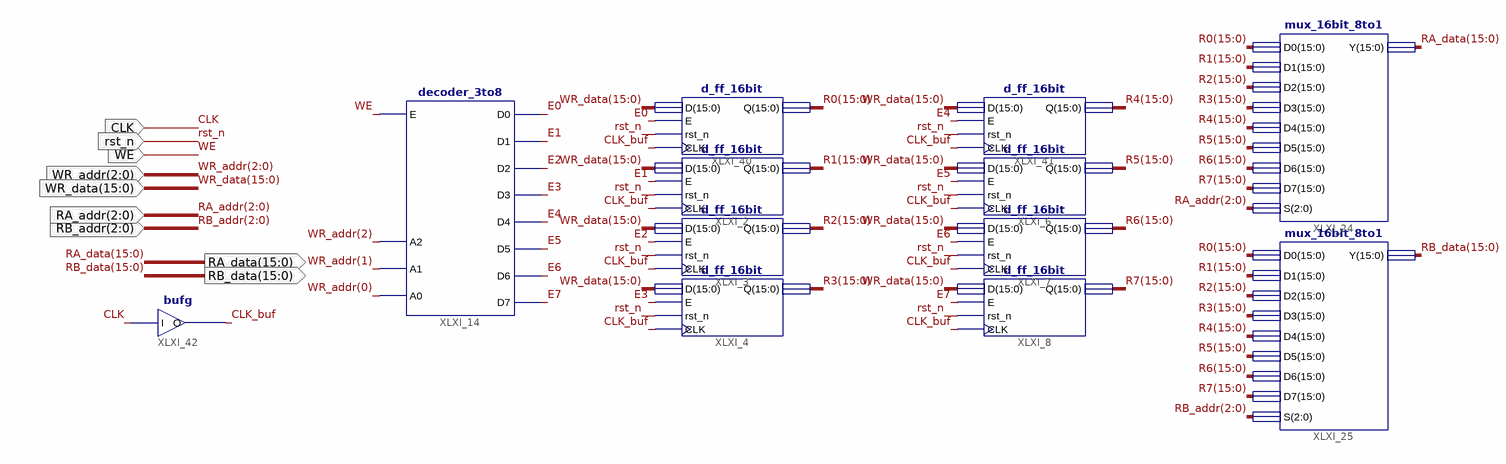
[diagram p0: schematic sheet 1]
// Xilinx ISE schematic regfile_16bit_8reg.sch (virtex6) as structural Verilog: 12 symbols, 9 ports
module regfile_16bit_8reg (
  input  WE,
  input  [15:0] WR_data,
  input  [2:0] WR_addr,
  input  [2:0] RB_addr,
  input  [2:0] RA_addr,
  input  CLK,
  input  rst_n,
  output [15:0] RA_data,
  output [15:0] RB_data
);

  wire CLK_buf, E0, E1, E2, E3, E4, E5, E6, E7;
  wire [15:0] R0, R1, R2, R3, R4, R5, R6, R7;

  decoder_3to8 XLXI_14 (
    .D0(E0), .D1(E1), .D2(E2), .D3(E3), .D4(E4), .D5(E5), .D6(E6), .D7(E7), .A0(WR_addr[0]), .A1(WR_addr[1]),
    .A2(WR_addr[2]), .E(WE));
  mux_16bit_8to1 XLXI_24 (
    .S(RA_addr), .D7(R7), .D6(R6), .D5(R5), .D4(R4), .D3(R3), .D2(R2), .D1(R1), .D0(R0), .Y(RA_data));
  mux_16bit_8to1 XLXI_25 (
    .S(RB_addr), .D7(R7), .D6(R6), .D5(R5), .D4(R4), .D3(R3), .D2(R2), .D1(R1), .D0(R0), .Y(RB_data));
  d_ff_16bit XLXI_8 (.E(E7), .D(WR_data), .Q(R7), .CLK(CLK_buf), .rst_n(rst_n));
  d_ff_16bit XLXI_4 (.E(E3), .D(WR_data), .Q(R3), .CLK(CLK_buf), .rst_n(rst_n));
  d_ff_16bit XLXI_7 (.E(E6), .D(WR_data), .Q(R6), .CLK(CLK_buf), .rst_n(rst_n));
  d_ff_16bit XLXI_3 (.E(E2), .D(WR_data), .Q(R2), .CLK(CLK_buf), .rst_n(rst_n));
  d_ff_16bit XLXI_6 (.E(E5), .D(WR_data), .Q(R5), .CLK(CLK_buf), .rst_n(rst_n));
  d_ff_16bit XLXI_2 (.E(E1), .D(WR_data), .Q(R1), .CLK(CLK_buf), .rst_n(rst_n));
  d_ff_16bit XLXI_40 (.E(E0), .D(WR_data), .Q(R0), .CLK(CLK_buf), .rst_n(rst_n));
  d_ff_16bit XLXI_41 (.E(E4), .D(WR_data), .Q(R4), .CLK(CLK_buf), .rst_n(rst_n));
  bufg XLXI_42 (.I(CLK), .O(CLK_buf));
endmodule
